# Altium schematic sheet ui_conn.SchDoc: mcHF Pro Transceiver UI board
size A3; Author: Krassi Atanassov; CompanyName: MØNKA; Engineer: For radio amateurs experimentation, non-commercial use only. Thank you!; Revision: 0.8.5; SheetTotal: 13
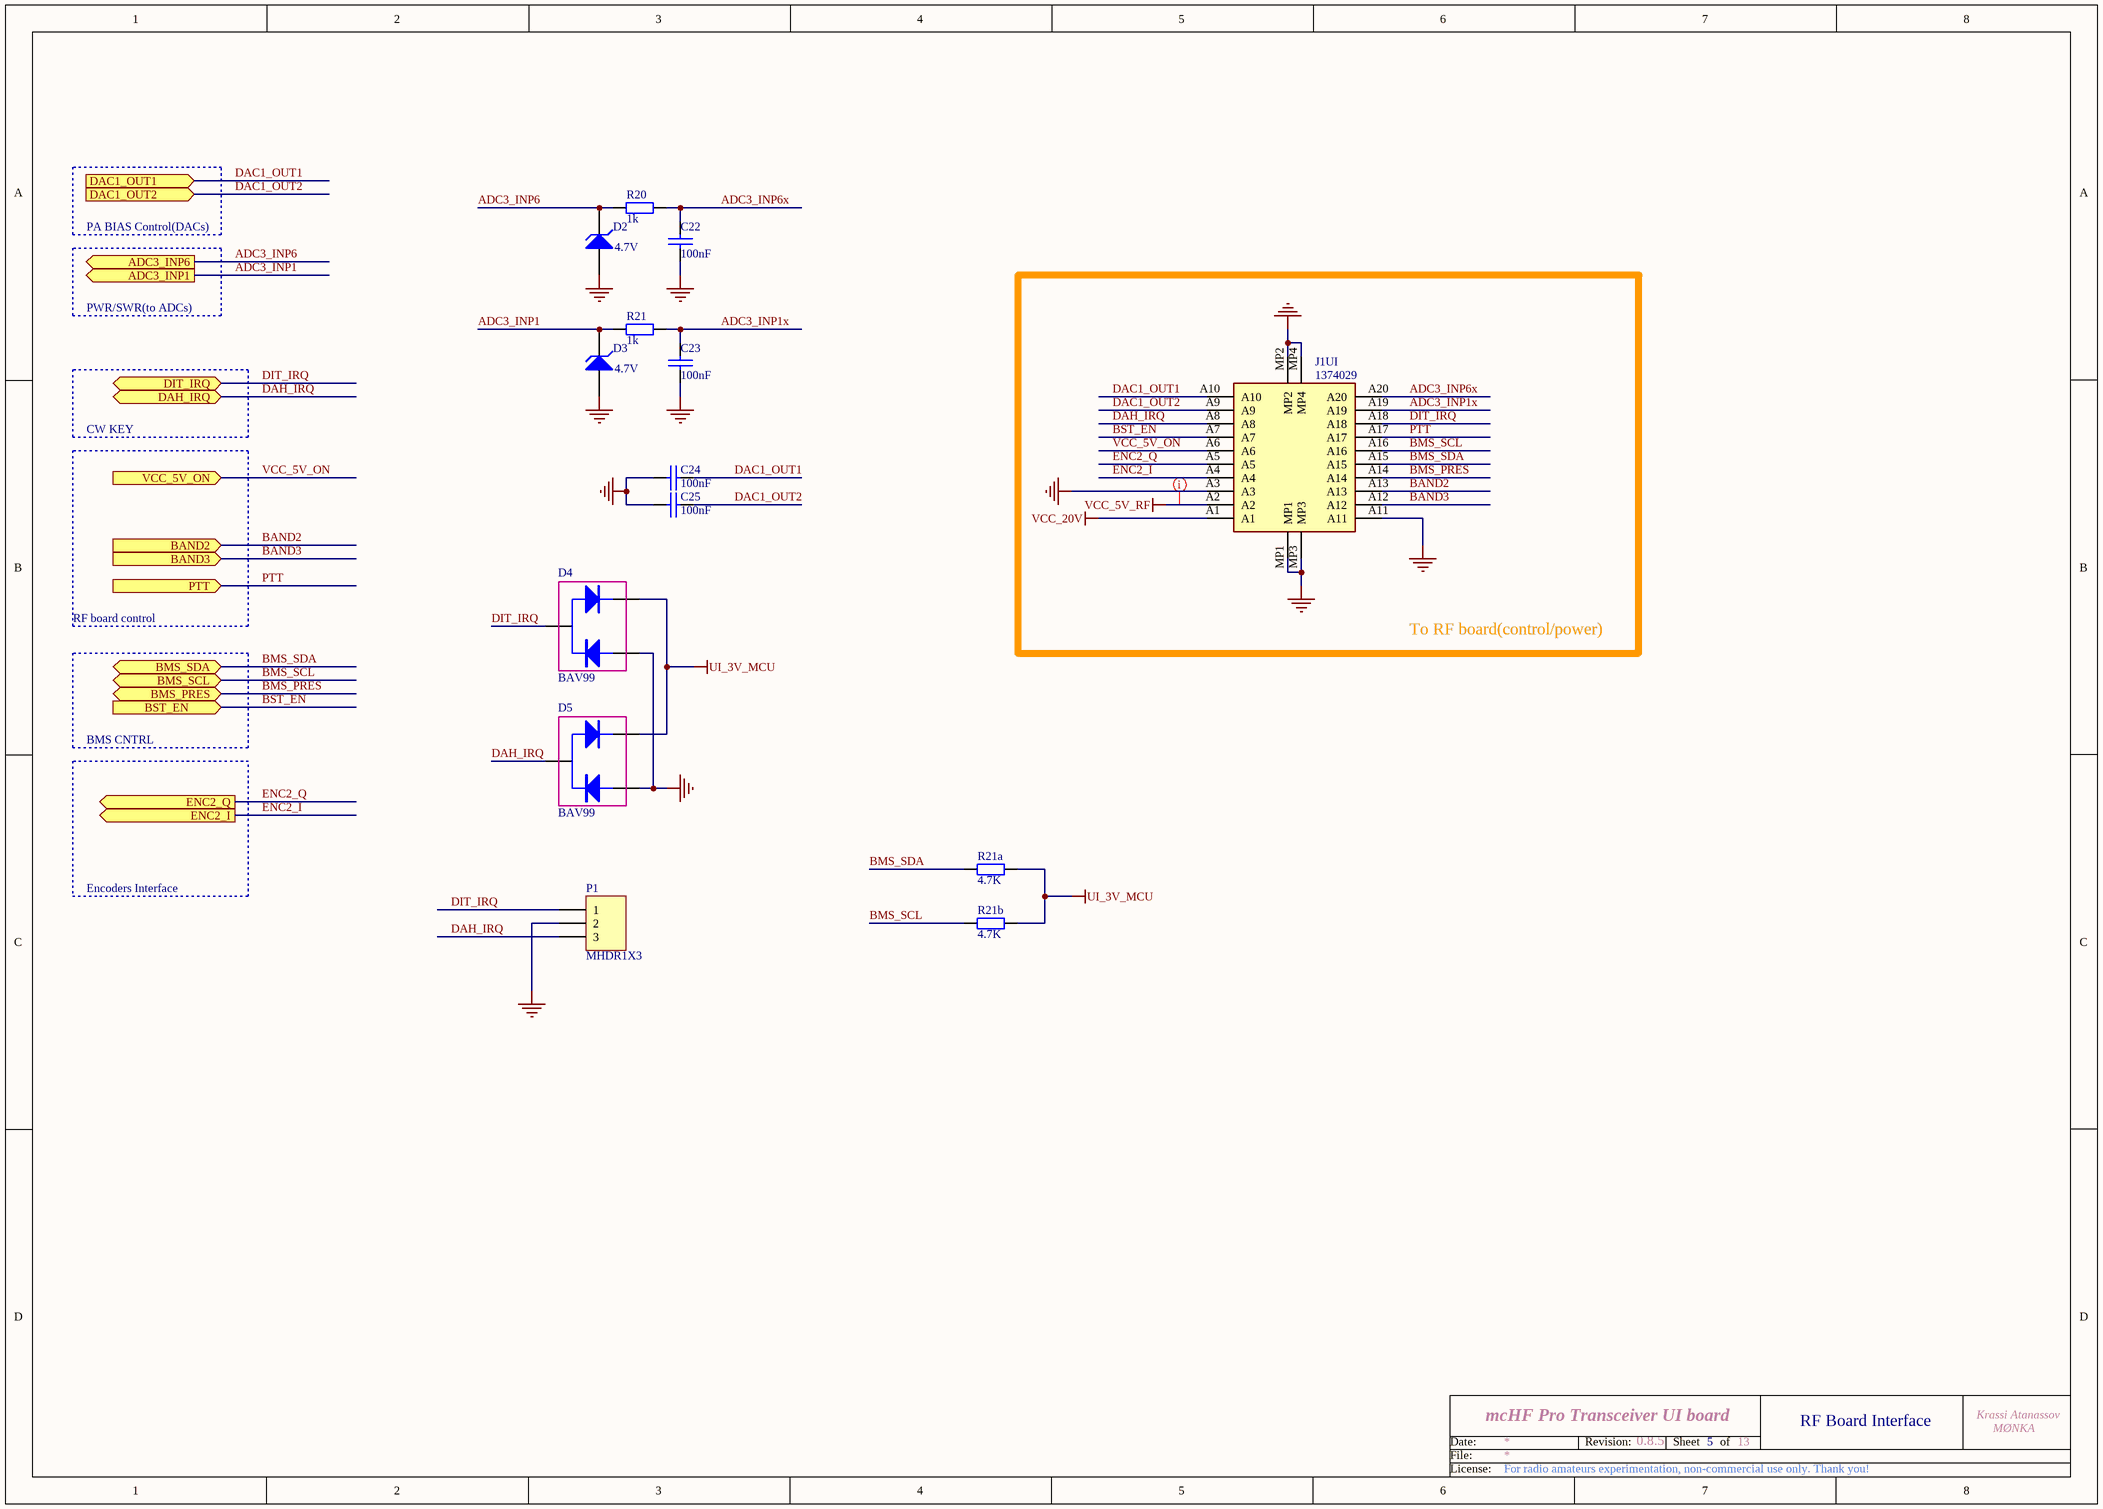
[diagram p0: ui_conn.SchDoc]

## Parts
C22  100nF  [0805]
C23  100nF  [0805]
C24  100nF  [0805]
C25  100nF  [0805]
D2  4.7V  [0805P]
D3  4.7V  [0805P]
D4  BAV99  [SOT-23]
D5  BAV99  [SOT-23]
J1UI  1374029  [1373866]
P1  MHDR1X3  [MHDR1X3]
R20  1k  [0805]
R21  1k  [0805]
R21a  4.7K  [0805]
R21b  4.7K  [0805]

## Blocks framed on the sheet
To RF board(control/power): J1UI

## Ports
ADC3_INP1 (out), ADC3_INP6 (out), BAND2 (in), BAND3 (in), BMS_PRES (bidir), BMS_SCL (bidir), BMS_SDA (bidir), BST_EN (in), DAC1_OUT1 (in), DAC1_OUT2 (in), DAH_IRQ (bidir), DIT_IRQ (bidir), ENC2_I (out), ENC2_Q (out), PTT (in), VCC_5V_ON (in)

## Nets
GND: C22.1 C23.1 C24.2 C25.2 D2.1(A) D3.1(A) D4.1(A1) D5.1(A1) J1UI.A3 J1UI.A11 J1UI.MP1 J1UI.MP2 J1UI.MP3 J1UI.MP4 P1.2
UI_3V_MCU: D4.2(K1) D5.2(K1) R21a.2 R21b.2
VCC_5V_RF: J1UI.A2
VCC_20V: J1UI.A1
ADC3_INP1: D3.2(K) R21.2 ; port ADC3_INP1
ADC3_INP1x: C23.2 J1UI.A19 R21.1
ADC3_INP6: D2.2(K) R20.2 ; port ADC3_INP6
ADC3_INP6x: C22.2 J1UI.A20 R20.1
BAND2: J1UI.A13 ; port BAND2
BAND3: J1UI.A12 ; port BAND3
BMS_PRES: J1UI.A14 ; port BMS_PRES
BMS_SCL: J1UI.A16 R21b.1 ; port BMS_SCL
BMS_SDA: J1UI.A15 R21a.1 ; port BMS_SDA
BST_EN: J1UI.A7 ; port BST_EN
DAC1_OUT1: C24.1 J1UI.A10 ; port DAC1_OUT1
DAC1_OUT2: C25.1 J1UI.A9 ; port DAC1_OUT2
DAH_IRQ: D5.3(C) J1UI.A8 P1.3 ; port DAH_IRQ
DIT_IRQ: D4.3(C) J1UI.A18 P1.1 ; port DIT_IRQ
ENC2_I: J1UI.A4 ; port ENC2_I
ENC2_Q: J1UI.A5 ; port ENC2_Q
PTT: J1UI.A17 ; port PTT
VCC_5V_ON: J1UI.A6 ; port VCC_5V_ON

## Layout directives
rule Width Constraint [Pref Width = 20mil    Min Width = 20mil    Max Width = 20mil]: VCC_5V_RF

## Notes on the sheet
- PA BIAS Control(DACs)
- PWR/SWR(to ADCs)
- CW KEY
- RF board control
- BMS CNTRL
- Encoders Interface
- 5
- RF Board Interface
- Date:
- File:
- Revision:
- Sheet
- of
- License:

## Library data of the parts
C22-C25 = CAP: Capacitor; Order: FN 252-2090; QT Order: QCC-00154; Price: 0.068
D2 D3 = D Zener: Zener Diode; Published: 8-Jun-2000; LatestRevisionDate: 17-Jul-2002; LatestRevisionNote: Re-released for DXP Platform.; PackageReference: DIODE-0.7; Publisher: Altium Limited; PackageDescription: Diode, Thru-Hole; 2 Leads; 0.7 in Pin Spacing
D4 = BAV99: Small Signal Diode, Dual Series; Order: FN 162-1837; QT Order: QCD-00039; Price: 0.0618
D5 = BAV99: Small Signal Diode, Dual Series; Order: FN 162-1837; Price: 0.0618
J1UI = 1373866: SMD male connector, nominal current: 2.2 A, Test voltage: 840 VAC, number of positions: 20, pitch: 1.27 mm, color: black, contact surface: Gold, type of contact: Male connector, mounting: SMD soldering; Manufacturer_Name: Phoenix Contact; Geometry.Height: 6.75mm; Mouser Part Number: 651-1373866; Mouser Price/Stock: https://www.mouser.co.uk/ProductDetail/Phoenix-Contact/1373866?qs=2SLPxufLcgAs0enIXKjUUw%3D%3D; Manufacturer_Part_Number: 1373866; Datasheet Link: http://www.phoenixcontact.com/gb/produkte/1373866
P1 = MHDR1X3: Header, 3-Pin; LatestRevisionDate: 17-Jul-2002; LatestRevisionNote: Re-released for DXP Platform.; Publisher: Altium Limited
R20 R21 = RES: Resistor; Order: FN 146-9899; QT Order: QCR-00309; Price: 0.023
R21a R21b = RES: Resistor; Order: FN 200-8383; QT Order: QCR-00341; Price: 0.024